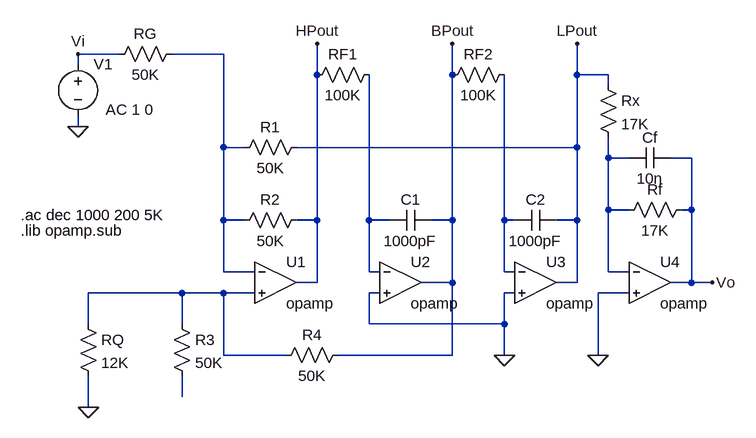
[diagram p0: schematic UAF42v2.asc]
UAF42v2.asc, the LTspice schematic file:
Version 4
SHEET 1 880 680
WIRE -144 -160 -208 -160
WIRE 16 -160 -64 -160
WIRE -208 -144 -208 -160
WIRE 160 -128 160 -176
WIRE 368 -128 368 -176
WIRE 560 -128 560 -176
WIRE 608 -128 560 -128
WIRE 608 -112 608 -128
WIRE -208 -48 -208 -64
WIRE 16 -16 16 -160
WIRE 48 -16 16 -16
WIRE 560 -16 560 -128
WIRE 560 -16 128 -16
WIRE 608 0 608 -32
WIRE 640 0 608 0
WIRE 736 0 704 0
WIRE 608 80 608 0
WIRE 640 80 608 80
WIRE 736 80 736 0
WIRE 736 80 720 80
WIRE 16 96 16 -16
WIRE 48 96 16 96
WIRE 160 96 160 -128
WIRE 160 96 128 96
WIRE 240 96 240 -128
WIRE 272 96 240 96
WIRE 368 96 368 -128
WIRE 368 96 336 96
WIRE 448 96 448 -128
WIRE 464 96 448 96
WIRE 560 96 560 -16
WIRE 560 96 528 96
WIRE 16 176 16 96
WIRE 64 176 16 176
WIRE 240 176 240 96
WIRE 256 176 240 176
WIRE 448 176 448 96
WIRE 464 176 448 176
WIRE 608 176 608 80
WIRE 640 176 608 176
WIRE 160 192 160 96
WIRE 160 192 128 192
WIRE 368 192 368 96
WIRE 368 192 320 192
WIRE 560 192 560 96
WIRE 560 192 528 192
WIRE 736 192 736 80
WIRE 736 192 704 192
WIRE 768 192 736 192
WIRE -48 208 -192 208
WIRE 16 208 -48 208
WIRE 64 208 16 208
WIRE 256 208 240 208
WIRE 464 208 448 208
WIRE 640 208 592 208
WIRE -192 256 -192 208
WIRE -48 256 -48 208
WIRE 240 256 240 208
WIRE 448 256 448 208
WIRE 448 256 240 256
WIRE 16 304 16 208
WIRE 112 304 16 304
WIRE 368 304 368 192
WIRE 368 304 192 304
WIRE 448 304 448 256
WIRE 592 304 592 208
WIRE -48 368 -48 336
WIRE -192 384 -192 336
FLAG 448 304 0
FLAG -192 384 0
FLAG 160 -176 HPout
FLAG 368 -176 BPout
FLAG 560 -176 LPout
FLAG -208 -160 Vi
FLAG 592 304 0
FLAG 768 192 Vo
FLAG -208 -48 0
SYMBOL OpAmps\\opamp 96 128 R0
SYMATTR InstName U1
SYMBOL OpAmps\\opamp 288 128 R0
SYMATTR InstName U2
SYMBOL OpAmps\\opamp 496 128 R0
SYMATTR InstName U3
SYMBOL OpAmps\\opamp 672 128 R0
SYMATTR InstName U4
SYMBOL cap 336 80 R90
WINDOW 0 0 32 VBottom 2
WINDOW 3 32 32 VTop 2
SYMATTR InstName C1
SYMATTR Value 1000pF
SYMBOL cap 528 80 R90
WINDOW 0 0 32 VBottom 2
WINDOW 3 32 32 VTop 2
SYMATTR InstName C2
SYMATTR Value 1000pF
SYMBOL res 144 80 R90
WINDOW 0 0 56 VBottom 2
WINDOW 3 32 56 VTop 2
SYMATTR InstName R2
SYMATTR Value 50K
SYMBOL res 144 -32 R90
WINDOW 0 0 56 VBottom 2
WINDOW 3 32 56 VTop 2
SYMATTR InstName R1
SYMATTR Value 50K
SYMBOL res 208 288 R90
WINDOW 0 0 56 VBottom 2
WINDOW 3 32 56 VTop 2
SYMATTR InstName R4
SYMATTR Value 50K
SYMBOL res 256 -144 R90
WINDOW 0 0 56 VBottom 2
WINDOW 3 32 56 VTop 2
SYMATTR InstName RF1
SYMATTR Value 100K
SYMBOL res 464 -144 R90
WINDOW 0 0 56 VBottom 2
WINDOW 3 32 56 VTop 2
SYMATTR InstName RF2
SYMATTR Value 100K
SYMBOL res -208 240 R0
SYMATTR InstName RQ
SYMATTR Value 12K
SYMBOL res -48 -176 R90
WINDOW 0 0 56 VBottom 2
WINDOW 3 32 56 VTop 2
SYMATTR InstName RG
SYMATTR Value 50K
SYMBOL res 592 -128 R0
SYMATTR InstName Rx
SYMATTR Value 17K
SYMBOL res 736 64 R90
WINDOW 0 0 56 VBottom 2
WINDOW 3 32 56 VTop 2
SYMATTR InstName Rf
SYMATTR Value 17K
SYMBOL cap 704 -16 R90
WINDOW 0 0 32 VBottom 2
WINDOW 3 32 32 VTop 2
SYMATTR InstName Cf
SYMATTR Value 10n
SYMBOL voltage -208 -160 R0
WINDOW 123 43 86 Left 2
WINDOW 39 0 0 Left 0
SYMATTR Value2 AC 1 0
SYMATTR InstName V1
SYMATTR Value ""
SYMBOL res -64 240 R0
SYMATTR InstName R3
SYMATTR Value 50K
TEXT -296 88 Left 2 !.ac dec 1000 200 5K
TEXT -296 112 Left 2 !.lib opamp.sub

The netlist it stands for:
* UAF42v2.asc
XU1 N001 N005 HPout opamp Aol=100K GBW=10Meg  ; pins invin noninvin out
XU2 N003 0 BPout opamp Aol=100K GBW=10Meg  ; pins invin noninvin out
XU3 N004 0 LPout opamp Aol=100K GBW=10Meg  ; pins invin noninvin out
XU4 N002 0 Vo opamp Aol=100K GBW=10Meg  ; pins invin noninvin out
C1 BPout N003 1000pF
C2 LPout N004 1000pF
R2 HPout N001 50K
R1 LPout N001 50K
R4 BPout N005 50K
RF1 N003 HPout 100K
RF2 N004 BPout 100K
RQ N005 0 12K
RG N001 Vi 50K
Rx LPout N002 17K
Rf Vo N002 17K
Cf Vo N002 10n
V1 Vi 0 AC 1 0
R3 N005 N006 50K
.ac dec 1000 200 5K
.lib opamp.sub
.backanno
.end